# EAGLE schematic projeson (EAGLE 6.3)
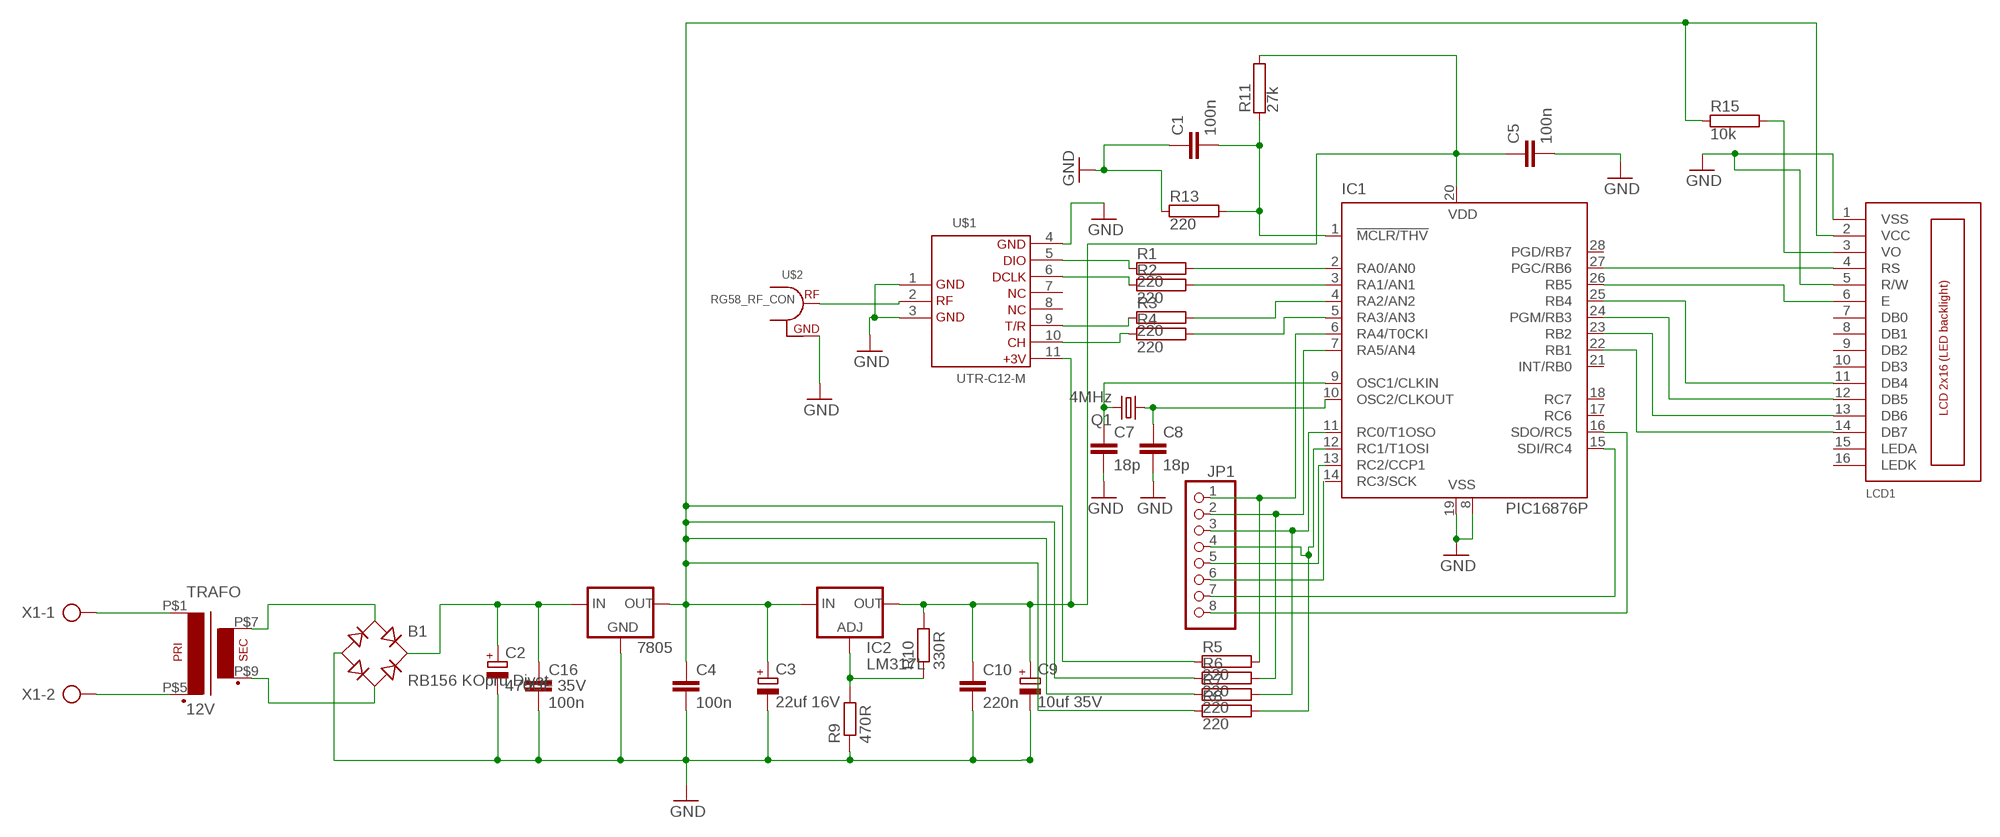
[diagram p0: schematic, sheet 1]

## Parts
7805  78XXS  [78XXS]
B1  RB156 KOpru Diyot  RB1A  [RB1A]
C1  100n  C-EU025-030X050  [C025-030X050]
C2  470UF 35V  CPOL-EUE3.5-10  [E3,5-10]
C3  22uf 16V  CPOL-EUE2.5-7  [E2,5-7]
C4  100n  C-EU050-025X075  [C050-025X075]
C5  100n  C-EU025-025X050  [C025-025X050]
C7  18p  C-EU025-025X050  [C025-025X050]
C8  18p  C-EU025-025X050  [C025-025X050]
C9  10uf 35V  CPOL-EUE2.5-7  [E2,5-7]
C10  220n  C-EU050-025X075  [C050-025X075]
C16  100n  C-EU050-025X075  [C050-025X075]
IC1  PIC16876P  [DIL28-3]
IC2  LM317L  [317L]
JP1  PINHD-1X8  [1X08]
LCD1  LCD_2X16_SIL  [HY-1602F]
Q1  4MHz  CRYTALHC49S  [HC49/S]
R1  220  RAC04  [AC04]
R2  220  RAC04  [AC04]
R3  220  RAC04  [AC04]
R4  220  RAC04  [AC04]
R5  220  RAC04  [AC04]
R6  220  RAC04  [AC04]
R7  220  RAC04  [AC04]
R8  220  RAC04  [AC04]
R9  470R  R-EU_0207/10  [0207/10]
R10  330R  R-EU_0207/10  [0207/10]
R11  27k  RAC04  [AC04]
R13  220  RAC04  [AC04]
R15  10k  RAC04  [AC04]
TRAFO  12V  TRAFO  [E3031TRF]
U$1  UTR-C12-M  [UTR-C12-M]
U$2  RG58_RF_CON  [RG58_RF_CON]
X1  AK300/3  [AK300/3]

## Nets
GND: 7805.GND B1.- C1.1 C2.- C3.- C4.2 C5.2 C7.2 C8.2 C9.- C10.2 C16.2 IC1.8(VSS) IC1.19(VSS) LCD1.1(VSS) LCD1.5(R/W) R9.1 R13.1 U$1.1 U$1.3 U$1.4 U$2.GND
N$1: R1.1 U$1.5
N$2: R3.1 U$1.9
N$3: IC1.4(RA2/AN2) R3.2
N$4: R4.1 U$1.10
N$5: IC1.2(RA0/AN0) R1.2
N$6: IC1.3(RA1/AN1) R2.2
N$8: IC1.5(RA3/AN3) R4.2
N$9: LCD1.3(VO) R15.2
N$10: IC1.6(RA4/T0CKI) JP1.1 R5.2
N$11: IC1.7(RA5/AN4) JP1.2 R6.2
N$12: IC1.11(RC0/T1OSO) JP1.3 R7.2
N$13: IC1.12(RC1/T1OSI) JP1.4 R8.2
N$14: IC1.13(RC2/CCP1) JP1.5
N$15: JP1.6
N$16: IC1.15(SDI/RC4) JP1.7
N$17: IC1.16(SDO/RC5) JP1.8
N$18: IC1.27(PGC/RB6) LCD1.4(RS)
N$19: IC1.26(RB5) LCD1.6(E)
N$20: IC1.25(RB4) LCD1.11(DB4)
N$21: IC1.24(PGM/RB3) LCD1.12(DB5)
N$22: IC1.23(RB2) LCD1.13(DB6)
N$23: IC1.22(RB1) LCD1.14(DB7)
N$24: TRAFO.P$5 X1.2
N$25: B1.AC1 TRAFO.P$7
N$26: B1.AC2 TRAFO.P$9
N$27: 7805.IN B1.+ C2.+ C16.1
N$28: TRAFO.P$1 X1.1
N$29: IC2.1(ADJ) R9.2 R10.1
N$31: U$1.2 U$2.RF
N$32: C1.2 IC1.1(!MCLR/THV) R11.1 R13.2
N$34: C7.1 IC1.9(OSC1/CLKIN) Q1.2
N$35: C8.1 IC1.10(OSC2/CLKOUT) Q1.1
N$37: R2.1 U$1.6
N$38: 7805.OUT C3.+ C4.1 IC2.3(IN) LCD1.2(VCC) R5.1 R6.1 R7.1 R8.1 R15.1
N$41: C5.1 C9.+ C10.1 IC1.20(VDD) IC2.2(OUT) R10.2 R11.2 U$1.11
Unconnected: IC1.14(RC3/SCK) IC1.17(RC6) IC1.18(RC7) IC1.21(INT/RB0) IC1.28(PGD/RB7) LCD1.7(DB0) LCD1.8(DB1) LCD1.9(DB2) LCD1.10(DB3) LCD1.15(LEDA) LCD1.16(LEDK) U$1.7 U$1.8 X1.3

## Library data of the parts
7805 = v-reg:78XXS: VOLTAGE REGULATOR
B1 = rectifier:RB1A: RECTIFIER 1 A
C1 C4 C5 C7 C8 C10 C16 = rcl:C-EU: CAPACITOR, European symbol
C2 C3 C9 = rcl:CPOL-EU: POLARIZED CAPACITOR, European symbol
IC1 = microchip:PIC16*876: MICROCONTROLLER flash type; OC_FARNELL: unknown; OC_NEWARK: unknown
IC2 = v-reg:LM317L: VOLTAGE REGULATOR
JP1 = pinhead:PINHD-1X8: PIN HEADER
LCD1 = lcd_2x16_led_backlight:LCD_2X16_SIL
Q1 = crystal:CRYTAL: CRYSTAL
R1-R8 R11 R13 R15 = resistor-power:R: Power Resitor; OC_FARNELL: unknown; OC_NEWARK: unknown
R9 R10 = rcl:R-EU_: RESISTOR, European symbol
TRAFO = UDEA3:TRAFO
U$1 = UDEA_HAKKI:UTR-C12-M
U$2 = UDEA_HAKKI:RG58_RF_CON
X1 = con-ptr500:AK300/3: CONNECTOR; OC_FARNELL: unknown; OC_NEWARK: unknown